# EAGLE design home_security v1 (EAGLE 9.7.0)
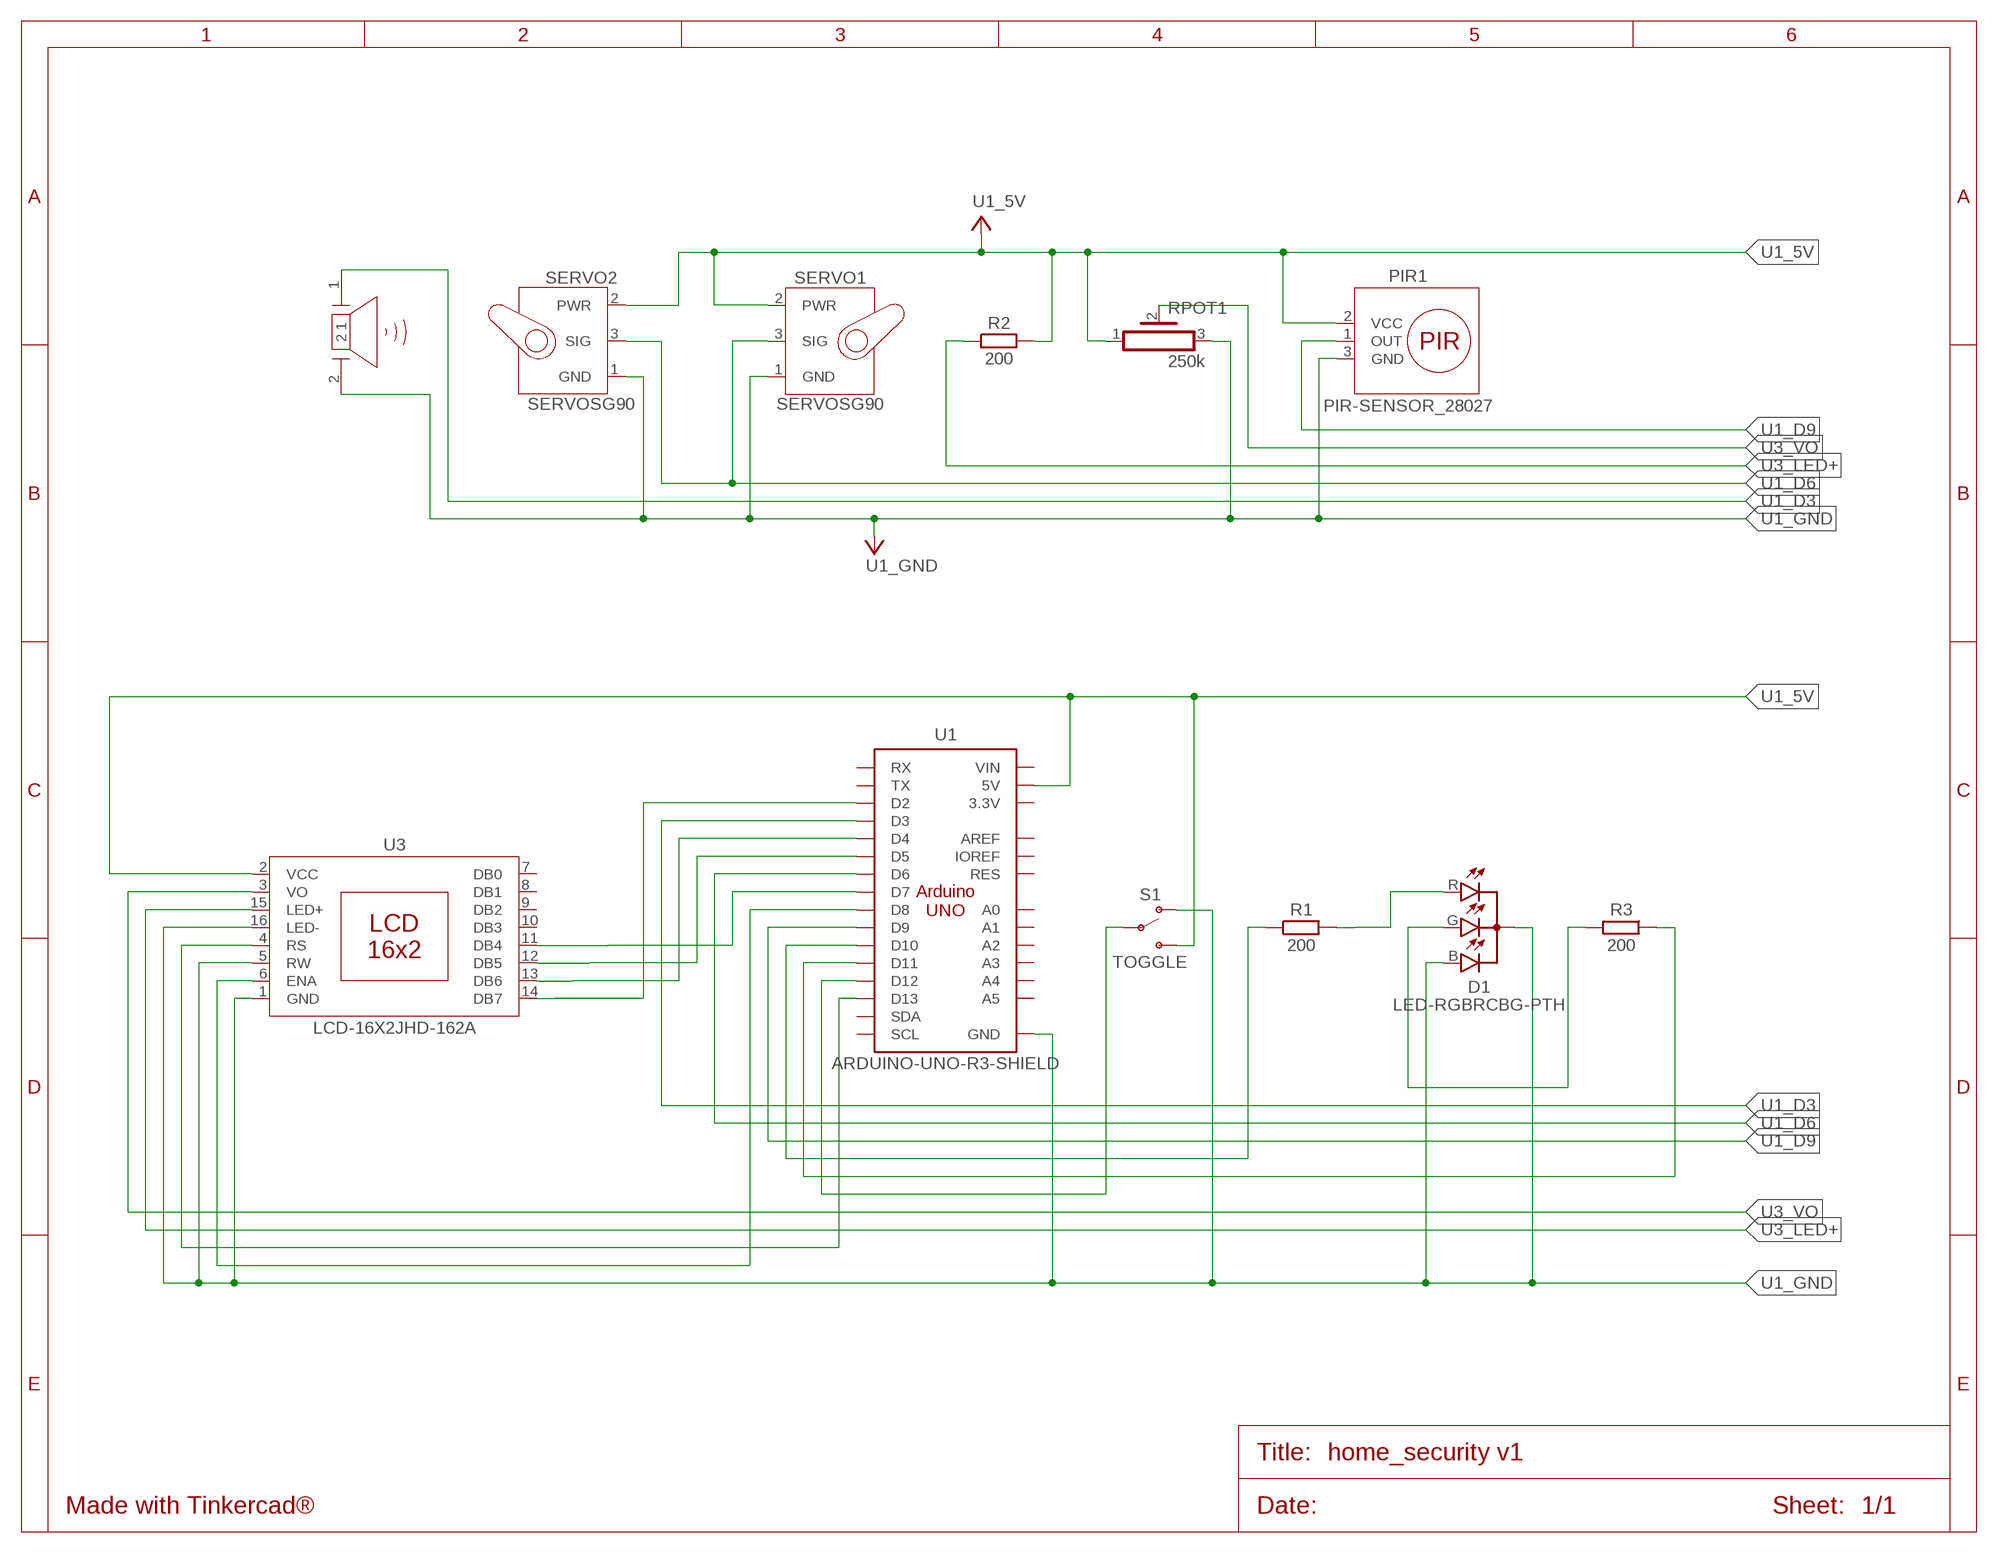
[diagram p0: schematic, sheet 1]

## Parts
D1  LED-RGBRCBG-PTH  [LED-RGB-5MM]
PIEZO1  PIEZO  [PIEZO]
PIR1  PIR-SENSOR_28027  [28027]
R1  200  RESISTOR_AXIAL-10.16MM-PITCH  [RESAD1016W63L850D250B]
R2  200  RESISTOR_AXIAL-10.16MM-PITCH  [RESAD1016W63L850D250B]
R3  200  RESISTOR_AXIAL-10.16MM-PITCH  [RESAD1016W63L850D250B]
RPOT1  250k  POT_HA-06  [HA-06-SM065]
S1  TOGGLE  [SWITCH-SPDT-PTH-8.5X3.7MM]
SERVO1  SERVOSG90  [SG90]
SERVO2  SERVOSG90  [SG90]
U1  ARDUINO-UNO-R3-SHIELD  [ARDUINO-UNO-R3-SHIELD]
U3  LCD-16X2JHD-162A  [JHD-162A]

## Nets
D1_G: D1.G R3.2
D1_R: D1.R R1.2
U1_5V: PIR1.2(VCC) R2.2 RPOT1.1 S1.3(S) SERVO1.2(PWR) SERVO2.2(PWR) U1.5V U3.2(VCC)
U1_D2: U1.D2 U3.14(DB7)
U1_D3: PIEZO1.1 U1.D3
U1_D4: U1.D4 U3.13(DB6)
U1_D5: U1.D5 U3.12(DB5)
U1_D6: SERVO1.3(SIG) SERVO2.3(SIG) U1.D6
U1_D7: U1.D7 U3.11(DB4)
U1_D8: U1.D8 U3.6(ENA)
U1_D9: PIR1.1(OUT) U1.D9
U1_D10: R1.1 U1.D10
U1_D11: R3.1 U1.D11
U1_D12: S1.2(P) U1.D12
U1_D13: U1.D13 U3.4(RS)
U1_GND: D1.B D1.C PIEZO1.2 PIR1.3(GND) RPOT1.3 S1.1(O) SERVO1.1(GND) SERVO2.1(GND) U1.GND@0(GND) U1.GND@1(GND) U1.GND@2(GND) U3.1(GND) U3.5(RW) U3.16(LED-)
U3_LED+: R2.1 U3.15(LED+)
U3_VO: RPOT1.2 U3.3(VO)
Unconnected: U1.3.3V U1.A0 U1.A1 U1.A2 U1.A3 U1.A4 U1.A5 U1.AREF U1.IOREF U1.RES U1.RX U1.SCL U1.SDA U1.TX U1.VIN U3.7(DB0) U3.8(DB1) U3.9(DB2) U3.10(DB3)

## Library data of the parts
D1 = Tinkercad:LED-RGB
PIEZO1 = Tinkercad:PIEZO: Piezoelectric Sounders / Buzzers Reference Datasheet <https://www.murata.com/products/productdata/8801054621726/SPEC-PKM17EPPH4001-B0.pdf?1517839212000>
PIR1 = Tinkercad:PIR-SENSOR
R1-R3 = Tinkercad:RESISTOR: Resistor Fixed - Generic
RPOT1 = Tinkercad:POT: Rectangular Trimmer Potentiometers - PV36 Series Datasheet <https://www.bourns.com/docs/Product-Datasheets/pv36.pdf>
S1 = Tinkercad:TOGGLE
SERVO1 SERVO2 = Tinkercad:SERVO
U1 = Tinkercad:ARDUINO-UNO-R3-SHIELD
U3 = Tinkercad:LCD-16X2

## Board
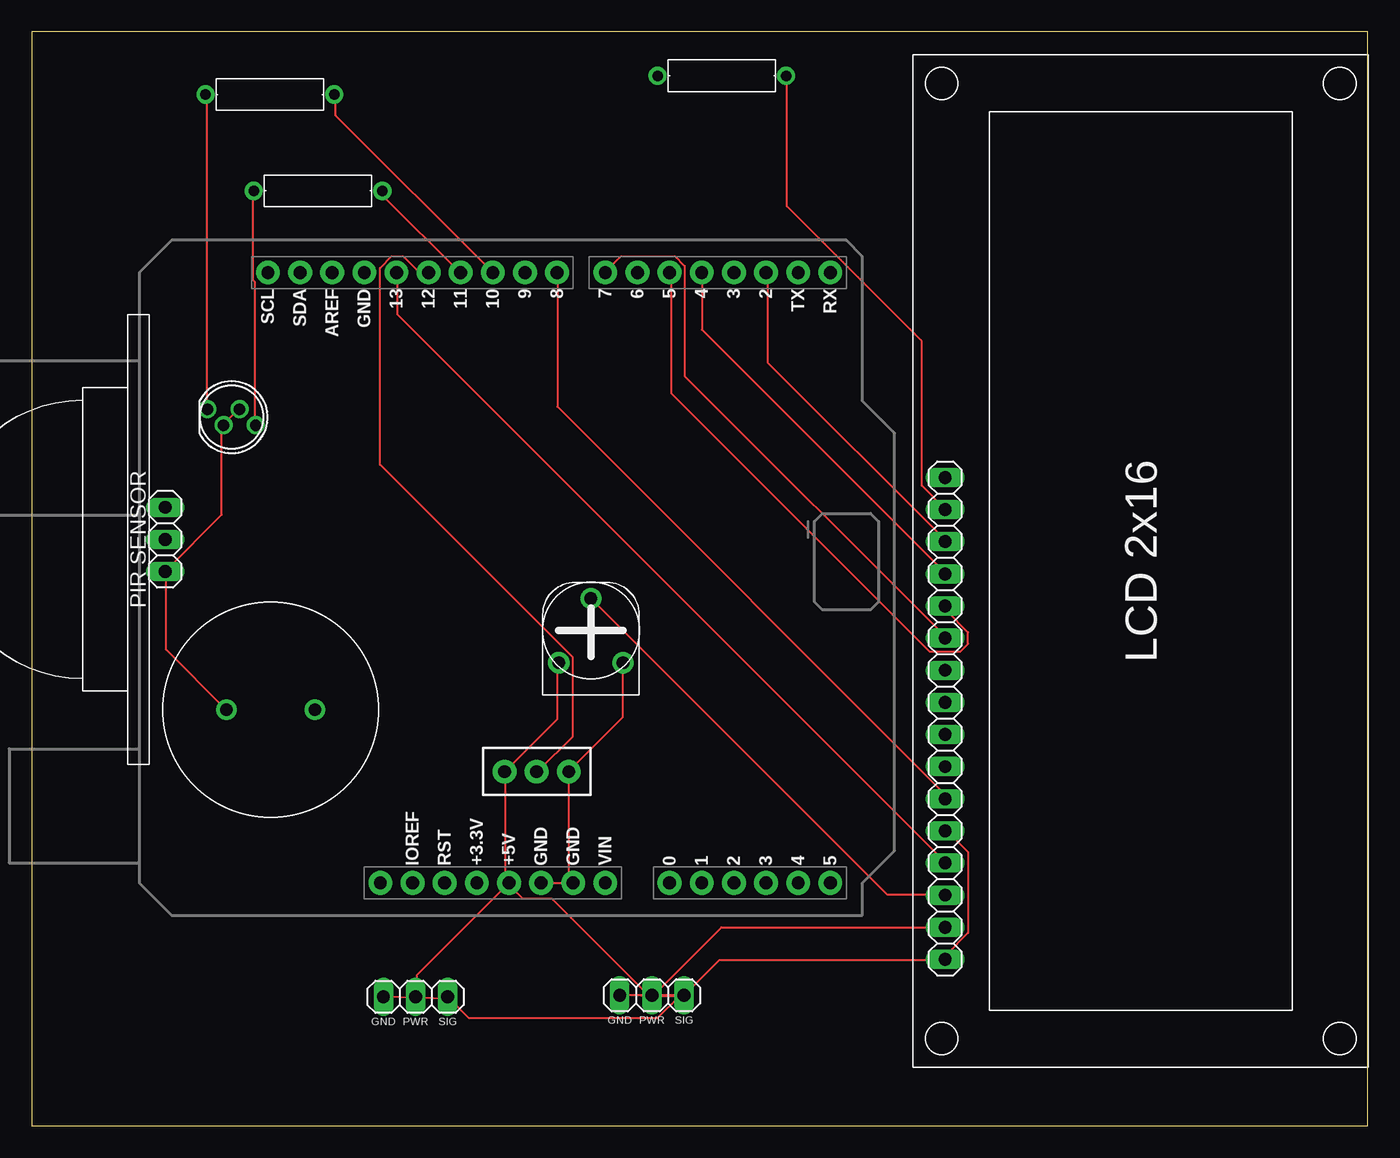
[diagram p1: board, top side]
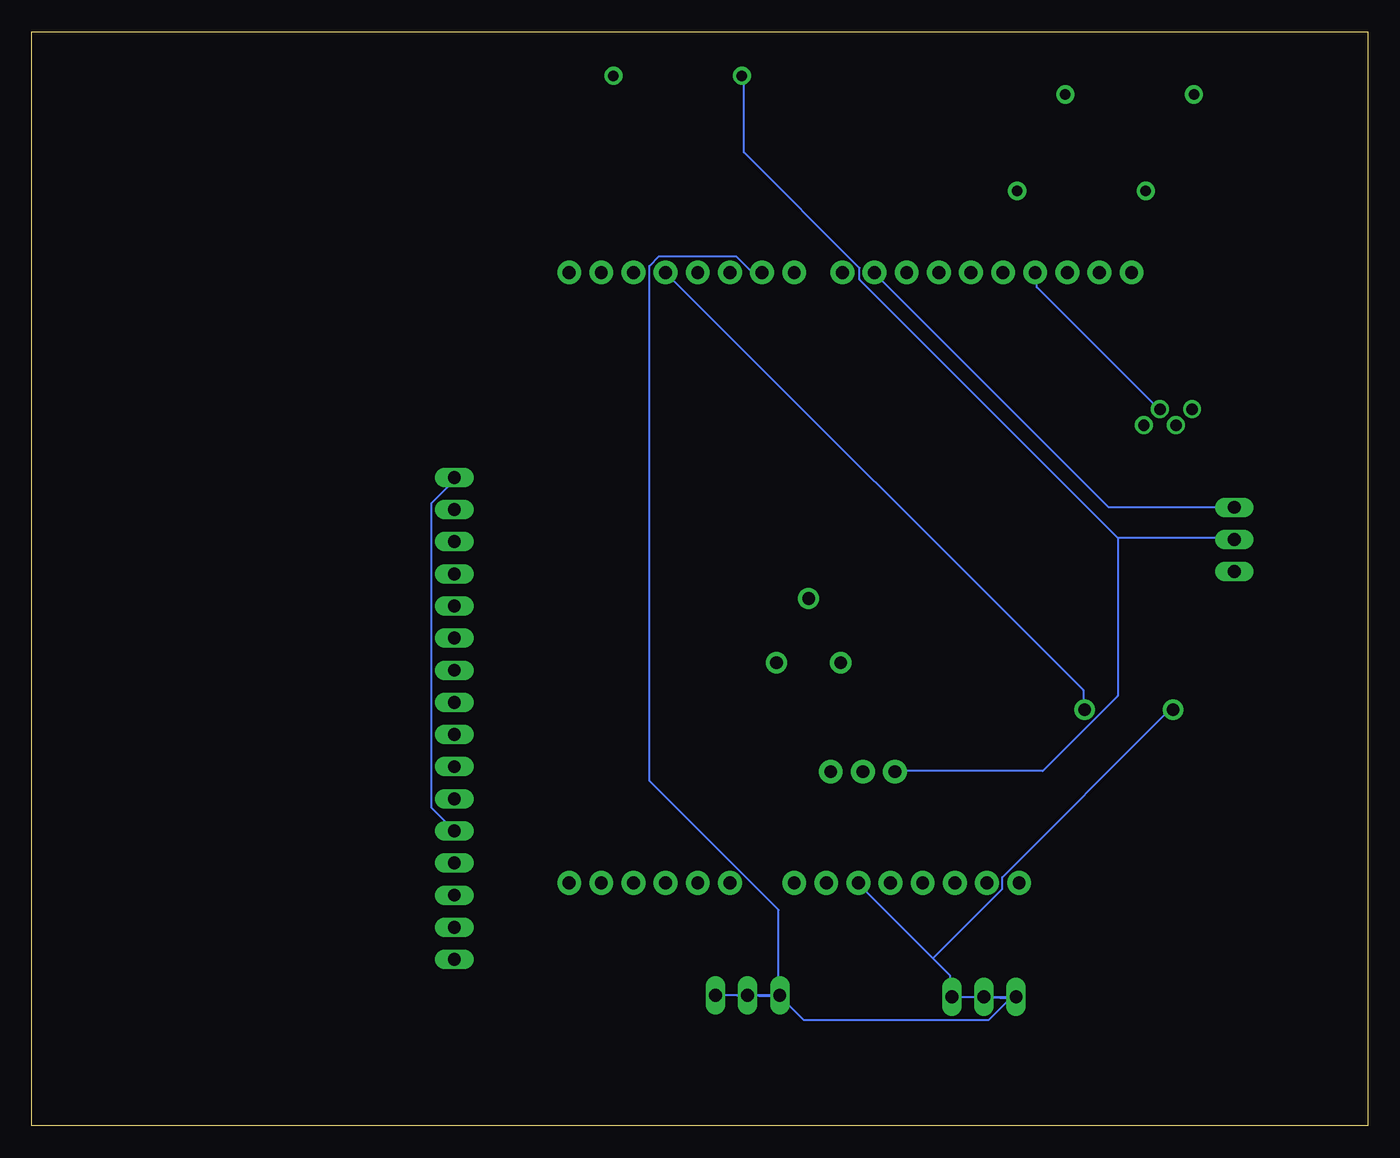
[diagram p2: board, bottom side, seen from below]

Size 105.61 x 86.49 mm. Coordinates in mm from the lower left corner, seen from the top.
Outline: 0,86.49 0,0 105.61,0 105.61,86.49 0,86.49
Copper layers (1*16): Top 0.035mm / dielectric 1.5mm / Bottom 0.035mm
Design rules "default": minimum track width 6mil, minimum drill 0.35mm, track to track 6mil, track to pad 6mil, pad to pad 6mil, via to via 6mil, smd to smd 6mil, copper to edge 40mil, drill to drill 6mil, minimum pad ring 10mil, minimum via ring 8mil, stop-mask expansion 4mil, vias tented up to drill 0mil, thermal gap 10mil

### Footprints (pad centres in the part's own frame; a part is rotated, then mirrored left to right if it is on the bottom)
LED-RGB-5MM = drill 0.9: B 0.635,0.635; C -0.635,-0.635; G 1.905,-0.635; R -1.905,0.635
PIEZO = drill 1 pad 1.6: 1 -3.5,0; 2 3.5,0
28027 = drill 1.016 long: 1 -2.54,0; 2 0,0; 3 2.54,0
RESAD1016W63L850D250B = drill 0.83 pad 1.43: 1 -5.08,0; 2 5.08,0
HA-06-SM065 = drill 1 pad 1.676: 1 -2.54,-2.54; 2 0,2.54; 3 2.54,-2.54
SWITCH-SPDT-PTH-8.5X3.7MM = drill 1.016 pad 1.88: 1 -2.54,0; 2 0,0; 3 2.54,0
SG90 = drill 1.016 long: 1 -2.54,0; 2 0,0; 3 2.54,0
ARDUINO-UNO-R3-SHIELD = drill 1.016 pad 1.88: 3.3V 24.13,-2.54; 5V 24.13,0; A0 24.13,12.7; A1 24.13,15.24; A2 24.13,17.78; A3 24.13,20.32; A4 24.13,22.86; A5 24.13,25.4; AREF -24.13,-13.97; D2 -24.13,20.32; D3 -24.13,17.78; D4 -24.13,15.24; D5 -24.13,12.7; D6 -24.13,10.16; D7 -24.13,7.62; D8 -24.13,3.81; D9 -24.13,1.27; D10 -24.13,-1.27; D11 -24.13,-3.81; D12 -24.13,-6.35; D13 -24.13,-8.89; GND@0 24.13,2.54; GND@1 24.13,5.08; GND@2 -24.13,-11.43; IOREF 24.13,-7.62; NC 24.13,-10.16; RES 24.13,-5.08; RX -24.13,25.4; SCL -24.13,-19.05; SDA -24.13,-16.51; TX -24.13,22.86; VIN 24.13,7.62
JHD-162A = drill 1.016 long: 1 -19.05,0; 2 -16.51,0; 3 -13.97,0; 4 -11.43,0; 5 -8.89,0; 6 -6.35,0; 7 -3.81,0; 8 -1.27,0; 9 1.27,0; 10 3.81,0; 11 6.35,0; 12 8.89,0; 13 11.43,0; 14 13.97,0; 15 16.51,0; 16 19.05,0

### Placement (x,y rotation side)
D1  15.8,56.02 0 top
PIEZO1  18.9,32.9 180 top
PIR1  10.55,46.36 270 top
R1  18.83,81.53 180 top
R2  54.56,83.01 180 top
R3  22.64,73.91 180 top
RPOT1  44.2,39.15 0 top
S1  39.92,28 180 top
SERVO1  49.03,10.32 0 top
SERVO2  30.34,10.2 0 top
U1  37.73,43.33 270 top
U3  72.21,32.21 90 top

### Tracks (layer width: path | path; a pad name or v marks a point on that pad's centre or on a via)
D1_G
  Top 0.152: D1.G 17.63,55.47 17.63,66.75 17.48,66.9 17.48,73.76 R3.2
D1_R
  Top 0.152: D1.R 13.82,56.69 13.82,81.38 R1.2
U1_5V
  Top 0.152: RPOT1.1 41.55,36.58 41.55,32.16 37.44,28.04 S1.3 37.44,27.89 37.44,19.36 37.59,19.2 U1.5V | SERVO2.2 30.43,10.21 30.43,11.89 37.59,19.05 U1.5V | U1.5V 37.74,19.05 38.81,17.98 41.1,17.98 48.72,10.36 49.02,10.36 SERVO1.2 49.17,10.36 54.51,15.7 72.19,15.7 U3.2
  Bottom 0.152: 19.76,46.48 40.18,66.9 40.18,67.82 49.33,76.96 49.33,82.91 R2.2 | 19.76,46.48 10.62,46.48 PIR1.2 | 19.76,46.48 19.76,33.98 25.71,28.04 37.29,28.04 S1.3
U1_D2
  Top 0.152: U3.14 72.19,46.33 58.17,60.35 58.17,67.36 U1.D2
U1_D3
  Bottom 0.152: PIEZO1.1 22.5,32.92 22.5,34.44 55.42,67.36 U1.D3
U1_D4
  Top 0.152: U3.13 72.19,43.74 52.98,62.94 52.98,67.36 U1.D4
U1_D5
  Top 0.152: U3.12 72.34,41 72.34,40.69 74.02,39.01 74.02,38.1 73.41,37.49 70.97,37.49 50.55,57.91 50.55,67.36 U1.D5
U1_D6
  Bottom 0.152: SERVO2.3 27.84,10.06 28.3,10.06 29.97,8.38 44.6,8.38 46.43,10.21 SERVO1.3 46.58,10.36 46.58,17.07 56.79,27.28 56.79,67.97 56.03,68.73 49.94,68.73 48.72,67.51 47.96,67.51 U1.D6
U1_D7
  Top 0.152: U3.11 72.19,38.71 51.61,59.28 51.61,67.97 50.85,68.73 46.58,68.73 45.36,67.51 U1.D7
U1_D8
  Top 0.152: U3.6 72.19,25.91 72.19,26.21 41.55,56.85 41.55,67.36 U1.D8
U1_D9
  Bottom 0.152: PIR1.1 10.62,48.92 20.52,48.92 38.96,67.36 U1.D9
U1_D10
  Top 0.152: R1.1 24.03,81.38 24.03,79.86 36.37,67.51 U1.D10
U1_D11
  Top 0.152: R3.1 27.84,73.76 27.84,73.46 33.78,67.51 U1.D11
U1_D12
  Top 0.152: U1.D12 31.34,67.51 30.58,67.51 29.36,68.73 28.45,68.73 27.53,67.82 27.53,52.27 42.77,37.03 42.77,30.79 40.03,28.04 S1.2
U1_D13
  Top 0.152: U3.4 72.19,20.88 28.91,64.16 28.91,67.36 U1.D13
U1_GND
  Top 0.152: D1.B 16.41,56.69 15.19,55.47 D1.C 15.04,55.32 15.04,48.31 10.62,43.89 PIR1.3 10.62,43.74 10.62,37.64 15.34,32.92 PIEZO1.2 | U3.5 72.34,23.32 74.02,21.64 74.02,15.24 72.34,13.56 72.34,13.26 U3.1 72.19,13.11 54.36,13.11 51.61,10.36 SERVO1.1 51.46,10.21 51.16,10.21 49.48,8.53 34.54,8.53 33.02,10.06 SERVO2.1 | RPOT1.3 46.74,36.58 46.74,32.31 42.47,28.04 S1.1 42.47,27.89 42.47,19.2 | 42.47,19.2 40.34,19.2 U1.GND@0 | 42.47,19.2 42.77,19.2 U1.GND@1 42.47,19.2
  Bottom 0.152: U1.GND@2 26.16,67.36 26.16,66.29 16.56,56.69 D1.B | U3.16 72.34,51.21 72.34,50.9 74.02,49.23 74.02,25.15 72.34,23.47 U3.5 | 34.39,13.26 40.18,19.05 U1.GND@0 | 34.39,13.26 33.02,11.89 33.02,10.21 SERVO2.1 | 34.39,13.26 28.91,18.74 28.91,19.66 15.8,32.77 15.49,32.77 PIEZO1.2
U3_LED+
  Top 0.152: R2.1 59.69,82.91 59.69,72.69 70.36,62.03 70.36,50.6 72.19,48.77 U3.15
U3_VO
  Top 0.152: U3.3 72.19,18.29 67.62,18.29 44.3,41.61 RPOT1.2